# Altium schematic sheet 06_NFC.SchDoc: =TitleParameter
size A3; Organization: ASISGUARD; Address1: Kemalpasa, Kemalpasa Cd. No:290 D:292H, 35060 Bornova/Izmir/Turkey; SheetNumber: 6; SheetTotal: 6
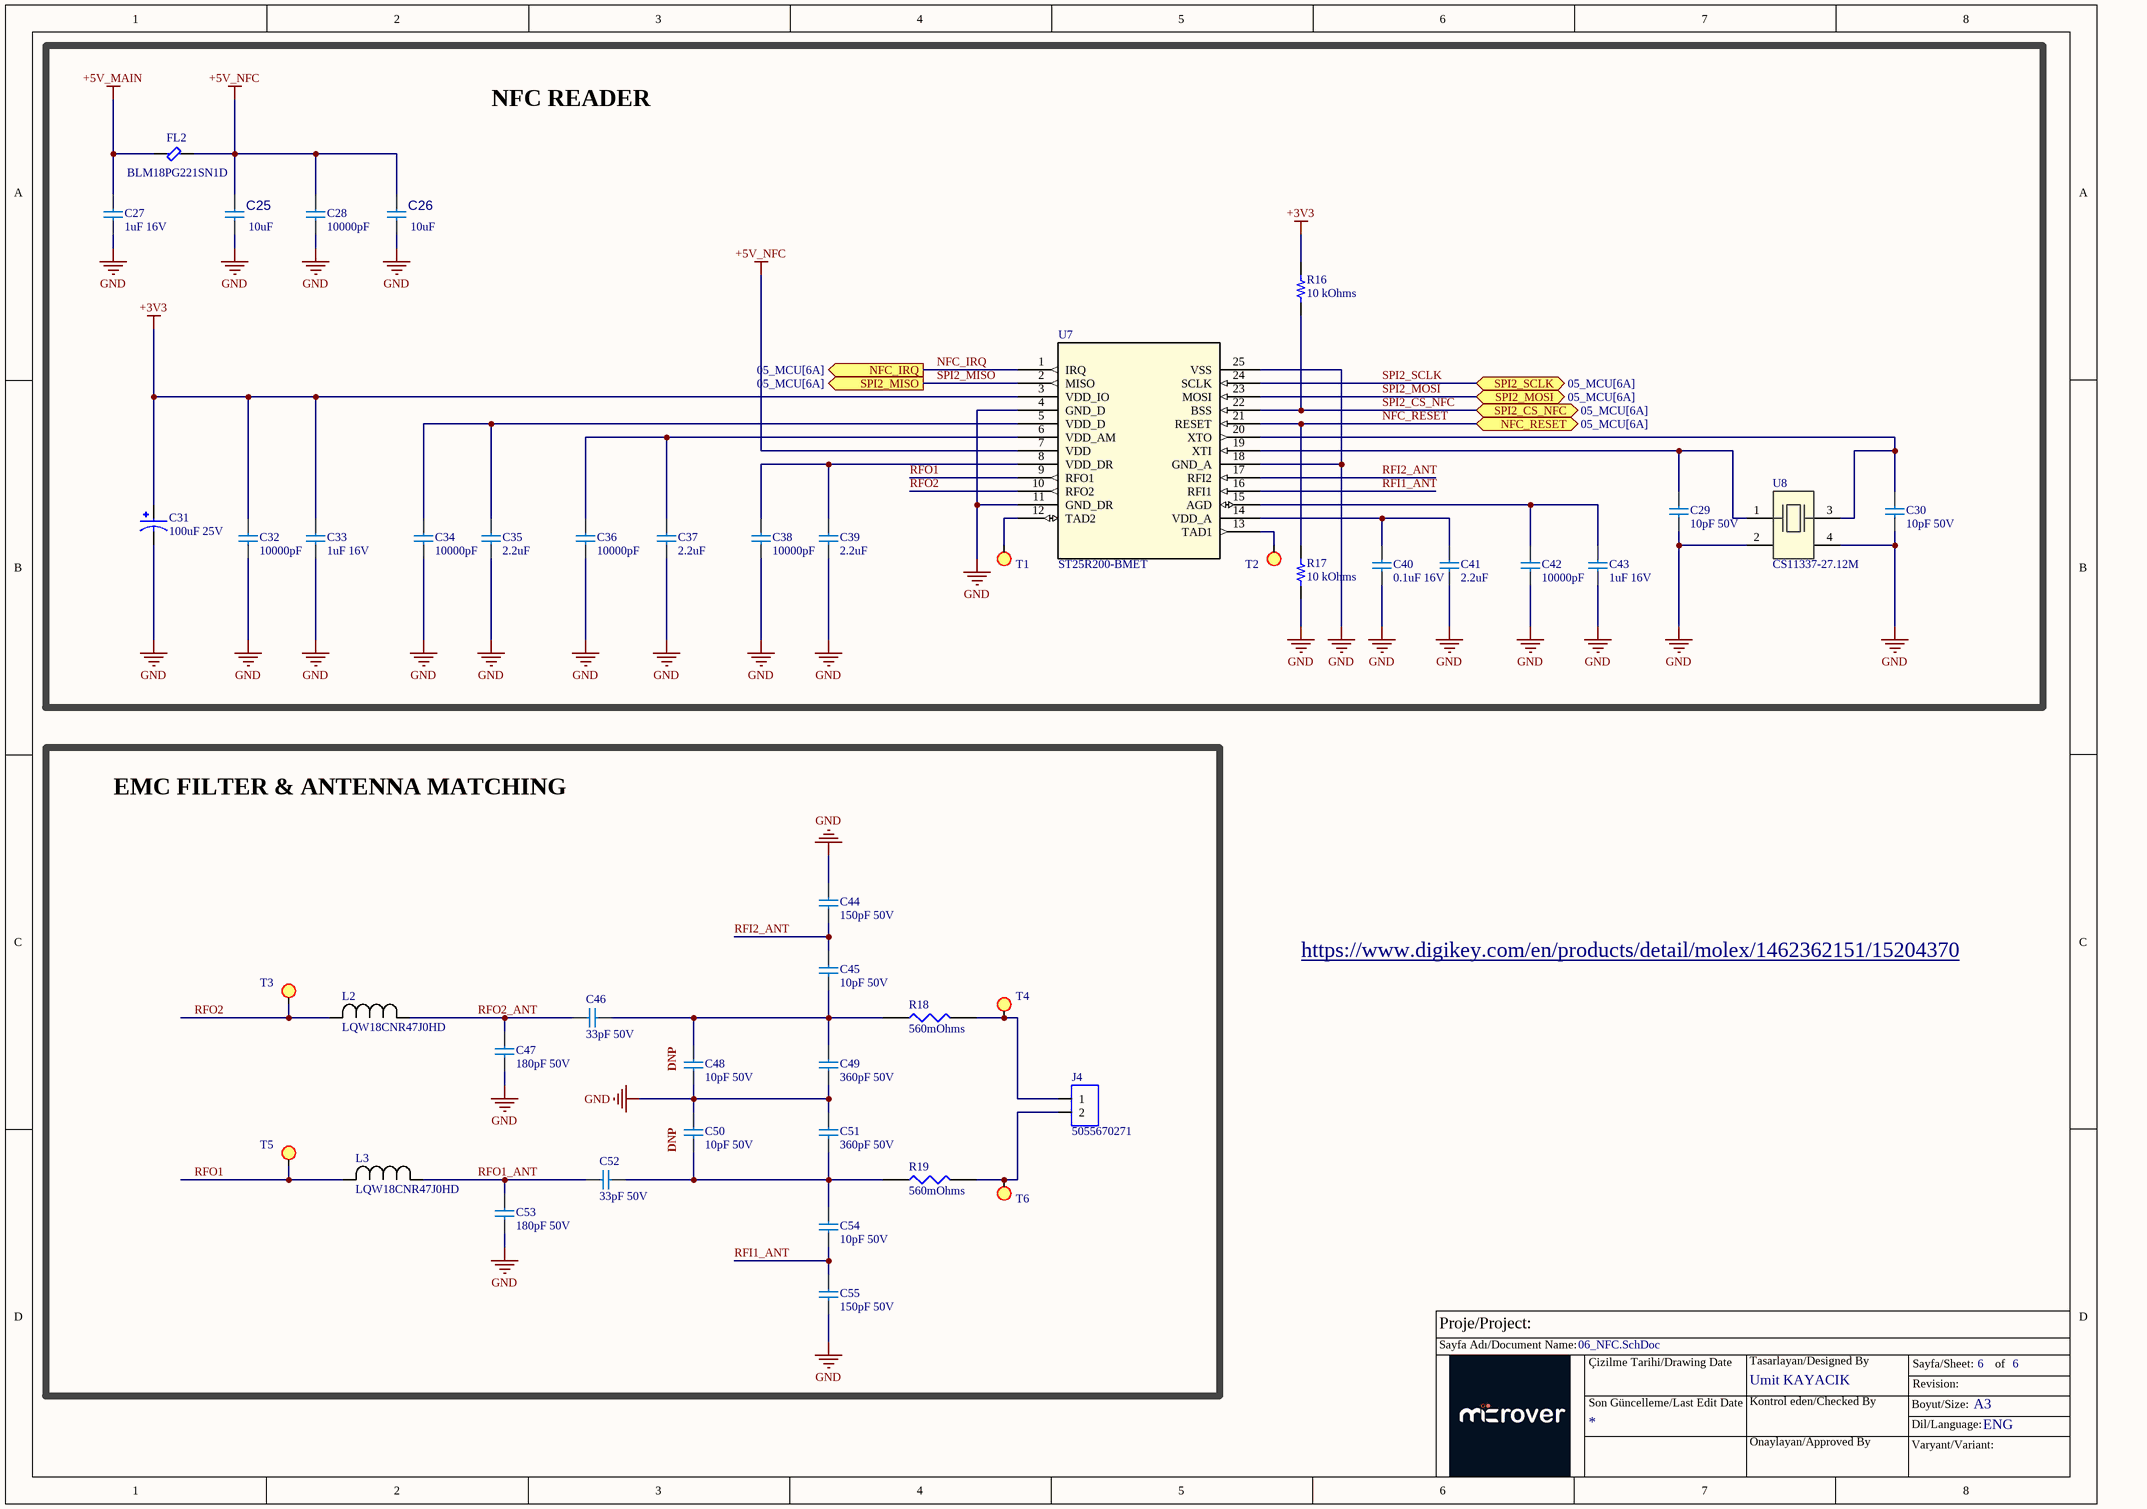
[diagram p0: 06_NFC.SchDoc]

## Parts
C25  10uF  [CAPC1608X100N]
C26  10uF  [CAPC1608X100N]
C27  1uF 16V  [CAPC1608X100N]
C28  10000pF  [CAPC1608X100N]
C29  10pF 50V  [CAPC1608X100N]
C30  10pF 50V  [CAPC1608X100N]
C31  100uF 25V  [CAP_25SVPF100M]
C32  10000pF  [CAPC1608X100N]
C33  1uF 16V  [CAPC1608X100N]
C34  10000pF  [CAPC1608X100N]
C35  2.2uF  [CAPC1608X100N]
C36  10000pF  [CAPC1608X100N]
C37  2.2uF  [CAPC1608X100N]
C38  10000pF  [CAPC1608X100N]
C39  2.2uF  [CAPC1608X100N]
C40  0.1uF 16V  [CAPC1608X100N]
C41  2.2uF  [CAPC1608X100N]
C42  10000pF  [CAPC1608X100N]
C43  1uF 16V  [CAPC1608X100N]
C44  150pF 50V  [CAPC1005X04L]
C45  10pF 50V  [CAPC1005X04L]
C46  33pF 50V  [CAPC1005X04L]
C47  180pF 50V  [CAPC1005X04L]
C48  10pF 50V  [CAPC1005X04L]
C49  360pF 50V  [CAPC1005X04L]
C50  10pF 50V  [CAPC1005X04L]
C51  360pF 50V  [CAPC1005X04L]
C52  33pF 50V  [CAPC1005X04L]
C53  180pF 50V  [CAPC1005X04L]
C54  10pF 50V  [CAPC1005X04L]
C55  150pF 50V  [CAPC1005X04L]
FL2  BLM18PG221SN1D  [BEADC1608X95N]
J4  5055670271  [CONN_505567_02_MOL]
L2  LQW18CNR47J0HD  [IND_LQW18CN_0H_MUR]
L3  LQW18CNR47J0HD  [IND_LQW18CN_0H_MUR]
R16  10 kOhms  [RES 0603_1608]
R17  10 kOhms  [RES 0603_1608]
R18  560mOhms  [RES_0402]
R19  560mOhms  [RES_0402]
T1  SMD  [TEST_POINT]  (value not drawn)
T2  SMD  [TEST_POINT]  (value not drawn)
T3  SMD  [TEST_POINT]  (value not drawn)
T4  SMD  [TEST_POINT]  (value not drawn)
T5  SMD  [TEST_POINT]  (value not drawn)
T6  SMD  [TEST_POINT]  (value not drawn)
U7  ST25R200-BMET  [UFQFPN24_STM]
U8  CS11337-27.12M  [NX2016SA2712MHZEXS00ACS11337]

## Blocks framed on the sheet
NFC READER: C25-C43 FL2 R16 R17 T1 T2 U7 U8
EMC FILTER & ANTENNA MATCHING: C44-C55 J4 L2 L3 R18 R19 T3-T6

## Ports
NFC_IRQ (out, see 05_MCU[6A]), NFC_RESET (bidir, see 05_MCU[6A]), SPI2_CS_NFC (bidir, see 05_MCU[6A]), SPI2_MISO (out, see 05_MCU[6A]), SPI2_MOSI (bidir, see 05_MCU[6A]), SPI2_SCLK (bidir, see 05_MCU[6A])

## Nets
+3V3: C31.1 C32.2 C33.2 R16.2 U7.3(VDD_IO)
+5V_MAIN: C27.2 FL2.1
+5V_NFC: C25.2 C26.2 C28.2 FL2.2 U7.7(VDD)
GND: C25.1() C26.1() C27.1 C28.1 C29.1 C30.1 C31.2 C32.1 C33.1 C34.1 C35.1 C36.1 C37.1 C38.1 C39.1 C40.1 C41.1 C42.1 C43.1 C44.2 C47.1 C48.1 C49.1 C50.2 C51.2 C53.1 C55.1 R17.1 U7.4(GND_D) U7.11(GND_DR) U7.18(GND_A) U7.25(VSS) U8.2(GND_1) U8.4(GND_2)
NFC_IRQ: U7.1(IRQ) ; port NFC_IRQ
NFC_RESET: R17.2 U7.21(RESET) ; port NFC_RESET
RFI1_ANT: C54.1 C55.2 U7.16(RFI1)
RFI2_ANT: C44.1 C45.2 U7.17(RFI2)
RFO1: L3.1 T5.1(TP) U7.9(RFO1)
RFO1_ANT: C52.2 C53.2 L3.2
RFO2: L2.1 T3.1(TP) U7.10(RFO2)
RFO2_ANT: C46.2 C47.2 L2.2
SPI2_CS_NFC: R16.1 U7.22(BSS) ; port SPI2_CS_NFC
SPI2_MISO: U7.2(MISO) ; port SPI2_MISO
SPI2_MOSI: U7.23(MOSI) ; port SPI2_MOSI
SPI2_SCLK: U7.24(SCLK) ; port SPI2_SCLK
NetC29_2: C29.2 U7.19(XTI) U8.1(CRYSTAL_1)
NetC30_2: C30.2 U7.20(XTO) U8.3(CRYSTAL_2)
NetC34_2: C34.2 C35.2 U7.5(VDD_D)
NetC36_2: C36.2 C37.2 U7.6(VDD_AM)
NetC38_2: C38.2 C39.2 U7.8(VDD_DR)
NetC40_2: C40.2 C41.2 U7.14(VDD_A)
NetC42_2: C42.2 C43.2 U7.15(AGD)
NetC45_1: C45.1 C46.1 C48.2 C49.2 R18.1
NetC50_1: C50.1 C51.1 C52.1 C54.2 R19.1
NetJ4_1: J4.1 R18.2 T4.1(TP)
NetJ4_2: J4.2 R19.2 T6.1(TP)
NetT1_1: T1.1(TP) U7.12(TAD2)
NetT2_1: T2.1(TP) U7.13(TAD1)

## Notes on the sheet
- https://www.digikey.com/en/products/detail/molex/1462362151/15204370
- (near C48) DNP
- (near C50) DNP
- Proje/Project:
- Sayfa Adı/Document Name:
- Çizilme Tarihi/Drawing Date
- Umit KAYACIK
- Tasarlayan/Designed By
- Sayfa/Sheet:
- Revision:
- of
- Son Güncelleme/Last Edit Date
- Kontrol eden/Checked By
- Onaylayan/Approved By
- Boyut/Size:
- Varyant/Variant:
- Dil/Language:
- A3
- ENG

## Library data of the parts
C25 C26 = CAP1461: CAP CER 10UF 25V X5R 0603; Manufacturer: Murata Electronics North America; Manufacturer Part Number: GRM188R61E106MA73D; Voltage: 25V; Revision: 1; Supplier Part Number: 490-7202-1-ND
C27 C33 C43 = VJ0603G105KXJCW1BC: Multilayer Ceramic Capacitors MLCC - SMD/SMT 0603 1.0uF 16volts X5R 10%
C28 C32 C34 C36 C38 C42 = C0603C103K4RECTU: 10000 pF ±10% 16V Ceramic Capacitor X7R 0603 (1608 Metric); Manufacturer: KEMET; Supplier: Digi; 399-C0603C103K4RECTUDKR-ND; JLCPCB PART#: 0603
C29 C30 = C0603C100F5GACAUTO: 10 pF ±1% 50V Ceramic Capacitor C0G, NP0 0603 (1608 Metric); Manufacturer: KEMET; Supplier: Digi; 399-C0603C100F5GACAUTODKR-ND
C31 = 25SVPF100M: 100 µF 25 V Aluminum - Polymer Capacitors Radial, Can - SMD 24mOhm 5000 Hrs @ 105°C; Manufacturer: Panasonic Industry; Supplier: Digi; P123675DKR-ND; JLCPCB PART#: C136279
C35 C37 C39 C41 = 0603X225K250CT: 2.2 µF ±10% 25V Ceramic Capacitor X5R 0603 (1608 Metric); Manufacturer: Walsin Technology Corporation; Supplier: Digi; 1292-0603X225K250CTDKR-ND; JLCPCB PART#: C237194
C40 = VJ0603Y104KXJAC: 0.1 µF ±10% 16V Ceramic Capacitor X7R 0603 (1608 Metric); Manufacturer: Vishay Vitramon; Supplier: Digi; 720-1377-6-ND
C44 C55 = GMC04CG151G50NT: 150 pF ±2% 50V Ceramic Capacitor C0G, NP0 0402 (1005 Metric); Manufacturer: Cal-Chip Electronics, Inc.; Supplier: Digi; 2571-GMC04CG151G50NTTR-ND
C45 C48 C50 C54 = GMC04CG100G50NT: CAP0402 COG 10PF 2% 50V; Manufacturer: Cal-Chip Electronics, Inc.; Supplier: Digi; 4713-GMC04CG100G50NTDKR-ND
C46 C52 = GMC04CG330F50NT: 33 pF ±1% 50V Ceramic Capacitor C0G, NP0 0402 (1005 Metric); Manufacturer: Cal-Chip Electronics, Inc.; Supplier: Digi; 2571-GMC04CG330F50NTTR-ND
C47 C53 = GMC04CG181F50NT: 180 pF ±1% 50V Ceramic Capacitor C0G, NP0 0402 (1005 Metric)
C49 C51 = GMC04CG361J50NT: 360 pF ±5% 50V Ceramic Capacitor C0G, NP0 0402 (1005 Metric); Manufacturer: Cal-Chip Electronics, Inc.; Supplier: Digi; 4713-GMC04CG361J50NTDKR-ND
FL2 = BLM18PG221SN1D: 220 Ohms @ 100 MHz 1 Power Line Ferrite Bead 0603 (1608 Metric) 1.4A 100mOhm; MF: Murata; MP: BLM18PG221SN1D; Value: *; Availability: Unavailable; SnapEDA_Link: https://www.snapeda.com/parts/BLM18PG221SN1D/Murata/view-part/236838/?ref=snap; Price: None; Package: 1608 Murata
J4 = 5055670271: Connector Header Surface Mount, Right Angle 2 position 0.049" (1.25mm); Manufacturer: Molex; Supplier: Digi; WM17038DKR-ND
L2 L3 = LQW18CNR47J0HD: Description; Manufacturer_Name: Murata; Copyright: Copyright (C) 2025 Ultra Librarian. All rights reserved.; Manufacturer_Part_Number: LQW18CNR47J0HD
R16 R17 = RNCS0603BKE10K0_1: RES 10K OHM 0.1% 1/16W 0603; Manufacturer: Stackpole Electronics Inc; Power (Watts): 0.063W, 1/16W; Temperature Coefficient: ±25ppm/°C; Part Number: RNCS0603BKE10K0; Value: 10 kOhms; ComponentLink1Description: Datasheet; ComponentLink1URL: https://www.seielect.com/catalog/sei-rncs_rnch.pdf; ComponentLink2Description: DigiKey Link; ComponentLink2URL: https://www.digikey.com/en/products/detail/stackpole-electronics-inc/RNCS0603BKE10K0/1708836; Composition: Thin Film; Device Package: 0603 (1608 Metric); Features: Anti-Corrosive, Automotive AEC-Q200, Moisture Resistant; Height - Seated (Max): 0.022" (0.55mm); LastUpdated: 2/9/2024 8:43:37 PM; Lifecycle Status: Active; Minimum Order: 1; Number of Terminations: 2; Operating Temperature: -55°C ~ 155°C; Package / Case: 0603 (1608 Metric); Packaging: TapeAndReel; PartId: 4838; Part Status: Active; Price: 0.06; Ratings: AEC-Q200; Resistance: 10 kOhms; Series: RNCS; Size / Dimension: 0.061" L x 0.031" W (1.55mm x 0.80mm); Supplier 1: DigiKey; Supplier Part Number 1: RNCS0603BKE10K0CT-ND; Supplier Device Package: 0603; Tolerance: ±0.1%
R18 R19 = RLP73K1ER56FTDF: 560 mOhms ±1% 0.125W, 1/8W Chip Resistor 0402 (1005 Metric) Current Sense Thick Film; Manufacturer: TE Connectivity Passive Product; Supplier: Digi; A109550DKR-ND
T1-T6 = TP: DESIG: testing PAD; FAB: NA; VAL: NOT POPULATED; PCB Footprint: test0_8-smd; REF: NA
U7 = ST25R200-BMET: Powerful general-purpose NFC reader for consumer and industrial applications; Manufacturer_Name: STMicroelectronics; Copyright: Copyright (C) 2025 Ultra Librarian. All rights reserved.; Manufacturer_Part_Number: ST25R200-BMET; RefDes: RefDes; Type: Type
U8 = CS11337-27.12M: 27.12 MHz ±30ppm Crystal 6pF 60 Ohms 4-SMD, No Lead; Manıfacturer: NDK (NIHON DEMPA KOGYO CO., LTD); Supplier: 644-CS11337-27.12MDKR-ND